# Altium schematic sheet Slot_periph.SchDoc: =title_
size 594 x 420 mm; Date: 06/04/2023; CheckedBy: EG; GD; GK; MS; DrawnBy: M. Gąska; DocumentNumber: 5; SheetNumber: 5; SheetTotal: 5; Title2: Slot periph; DivGrp: BE-CO; Projet: DI/OT Crate; Designer: G.Daniluk; CreateDate: 06/04/2023; CheckedDate: 06/04/2023
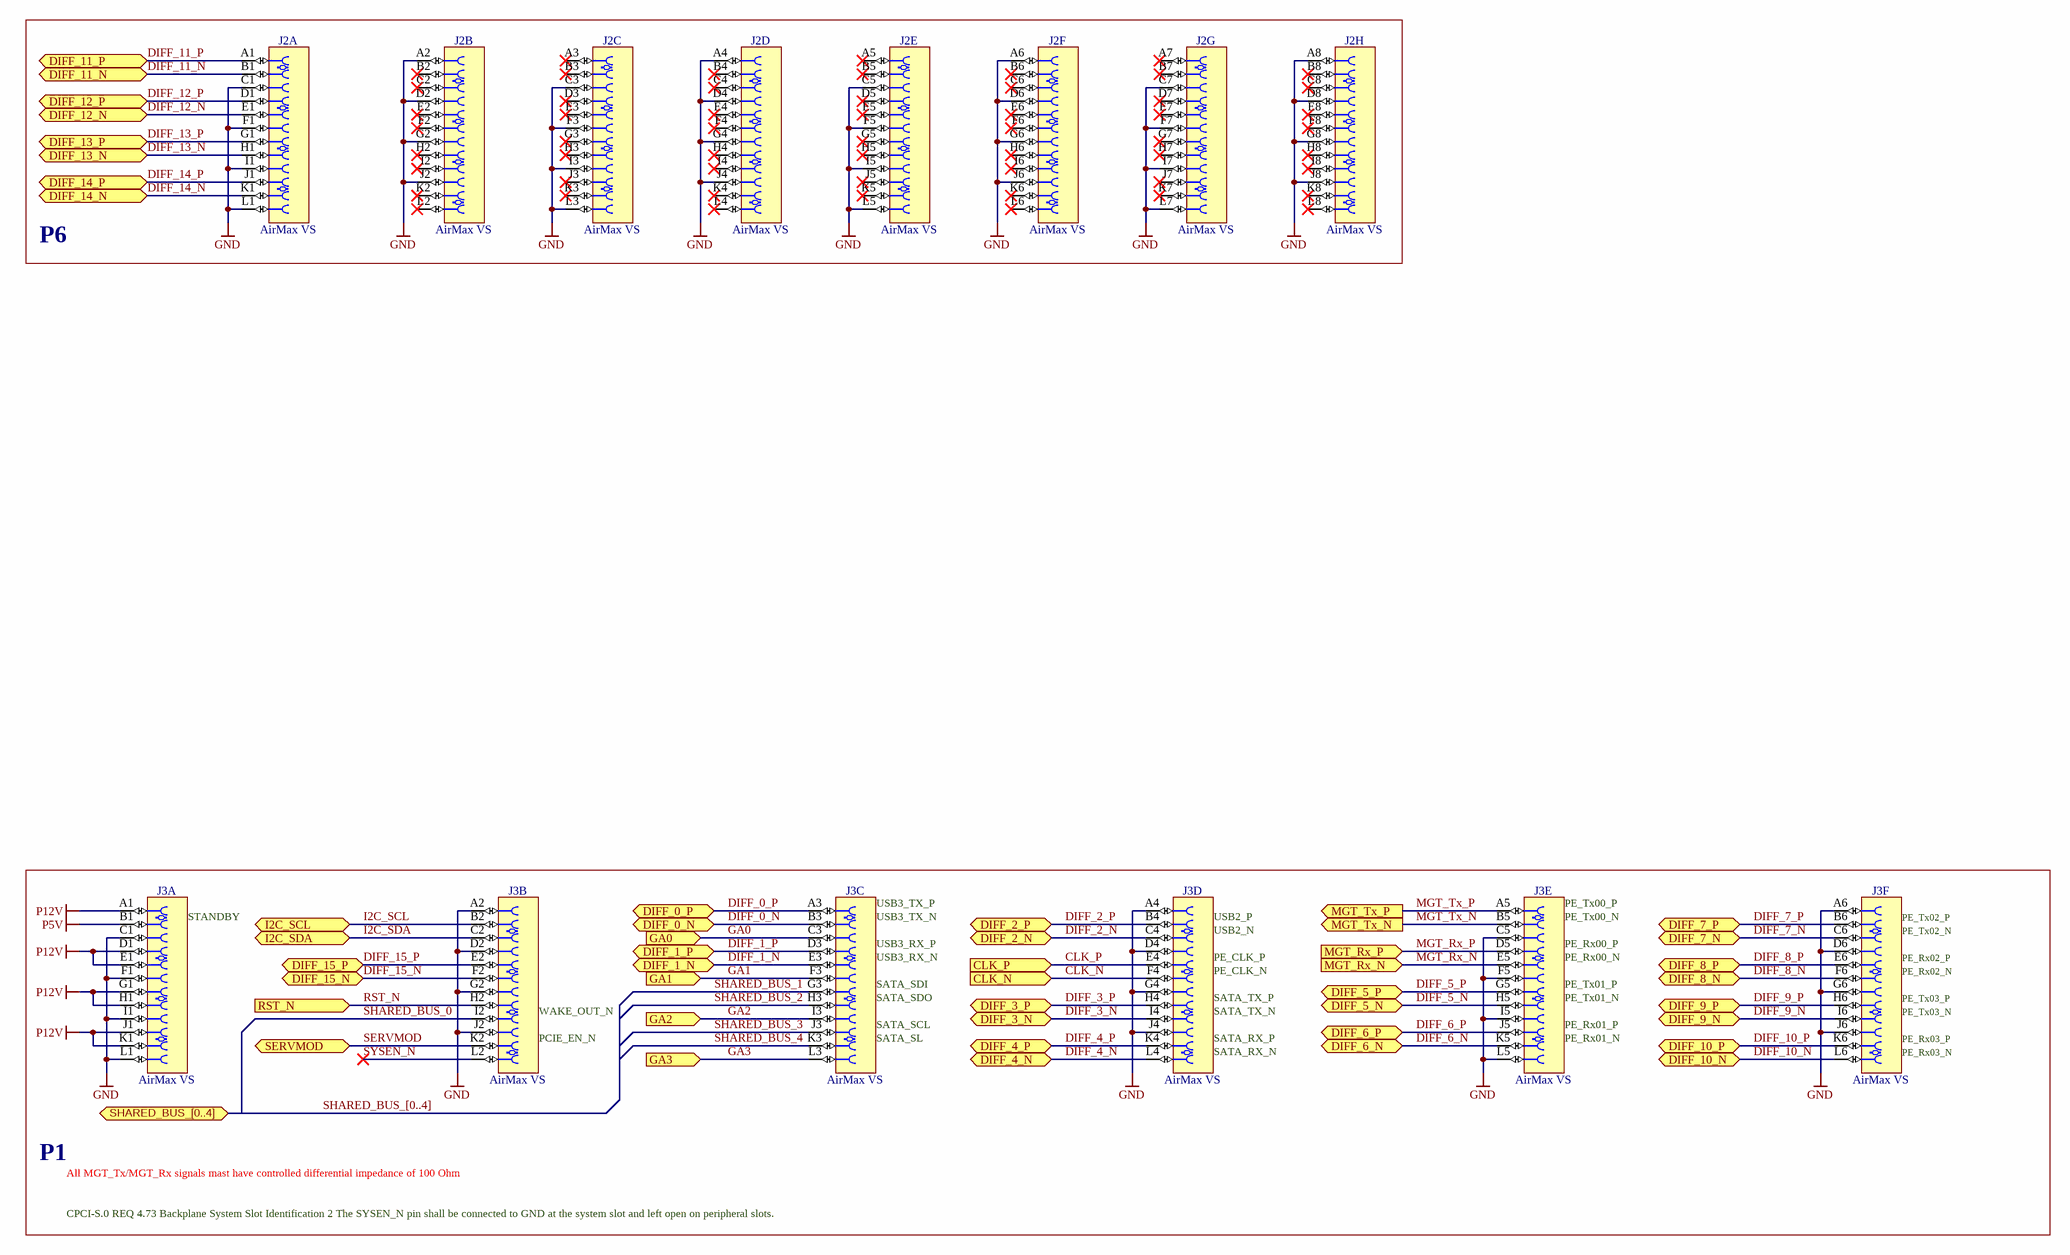
[diagram p0: Slot_periph.SchDoc]

## Parts
J2  AirMax VS  [AMPHENOL_10052842-101LF]  (parts A,B,C,D,E,F,G,H of 8)
J3  AirMax VS  [AMPHENOL_10052829-101LF]  (parts A,B,C,D,E,F of 6)

## Blocks framed on the sheet
P6: J2
P1: J3

## Ports
CLK_N (in), CLK_P (in), DIFF_0_N (bidir), DIFF_0_P (bidir), DIFF_1_N (bidir), DIFF_1_P (bidir), DIFF_2_N (bidir), DIFF_2_P (bidir), DIFF_3_N (bidir), DIFF_3_P (bidir), DIFF_4_N (bidir), DIFF_4_P (bidir), DIFF_5_N (bidir), DIFF_5_P (bidir), DIFF_6_N (bidir), DIFF_6_P (bidir), DIFF_7_N (bidir), DIFF_7_P (bidir), DIFF_8_N (bidir), DIFF_8_P (bidir), DIFF_9_N (bidir), DIFF_9_P (bidir), DIFF_10_N (bidir), DIFF_10_P (bidir), DIFF_11_N (bidir), DIFF_11_P (bidir), DIFF_12_N (bidir), DIFF_12_P (bidir), DIFF_13_N (bidir), DIFF_13_P (bidir), DIFF_14_N (bidir), DIFF_14_P (bidir), DIFF_15_N (bidir), DIFF_15_P (bidir), GA0 (in), GA1 (in), GA2 (in), GA3 (in), I2C_SCL (bidir), I2C_SDA (bidir), MGT_Rx_N (in), MGT_Rx_P (in), MGT_Tx_N (out), MGT_Tx_P (out), RST_N (in), SERVMOD (bidir), SHARED_BUS_[0..4] (bidir)

## Nets
GND: J2.A2 J2.A4 J2.A6 J2.A8 J2.C1 J2.C3 J2.C5 J2.C7 J2.D2 J2.D4 J2.D6 J2.D8 J2.F1 J2.F3 J2.F5 J2.F7 J2.G2 J2.G4 J2.G6 J2.G8 J2.I1 J2.I3 J2.I5 J2.I7 J2.J2 J2.J4 J2.J6 J2.J8 J2.L1 J2.L3 J2.L5 J2.L7 J3.A2 J3.A4 J3.A6 J3.C1 J3.C5 J3.D2 J3.D4 J3.D6 J3.F1 J3.F5 J3.G2 J3.G4 J3.G6 J3.I1 J3.I5 J3.J2 J3.J4 J3.J6 J3.L1 J3.L5
P5V: J3.B1
P12V: J3.A1 J3.D1 J3.E1 J3.G1 J3.H1 J3.J1 J3.K1
CLK_N: J3.F4 ; port CLK_N
CLK_P: J3.E4 ; port CLK_P
DIFF_0_N: J3.B3 ; port DIFF_0_N
DIFF_0_P: J3.A3 ; port DIFF_0_P
DIFF_1_N: J3.E3 ; port DIFF_1_N
DIFF_1_P: J3.D3 ; port DIFF_1_P
DIFF_2_N: J3.C4 ; port DIFF_2_N
DIFF_2_P: J3.B4 ; port DIFF_2_P
DIFF_3_N: J3.I4 ; port DIFF_3_N
DIFF_3_P: J3.H4 ; port DIFF_3_P
DIFF_4_N: J3.L4 ; port DIFF_4_N
DIFF_4_P: J3.K4 ; port DIFF_4_P
DIFF_5_N: J3.H5 ; port DIFF_5_N
DIFF_5_P: J3.G5 ; port DIFF_5_P
DIFF_6_N: J3.K5 ; port DIFF_6_N
DIFF_6_P: J3.J5 ; port DIFF_6_P
DIFF_7_N: J3.C6 ; port DIFF_7_N
DIFF_7_P: J3.B6 ; port DIFF_7_P
DIFF_8_N: J3.F6 ; port DIFF_8_N
DIFF_8_P: J3.E6 ; port DIFF_8_P
DIFF_9_N: J3.I6 ; port DIFF_9_N
DIFF_9_P: J3.H6 ; port DIFF_9_P
DIFF_10_N: J3.L6 ; port DIFF_10_N
DIFF_10_P: J3.K6 ; port DIFF_10_P
DIFF_11_N: J2.B1 ; port DIFF_11_N
DIFF_11_P: J2.A1 ; port DIFF_11_P
DIFF_12_N: J2.E1 ; port DIFF_12_N
DIFF_12_P: J2.D1 ; port DIFF_12_P
DIFF_13_N: J2.H1 ; port DIFF_13_N
DIFF_13_P: J2.G1 ; port DIFF_13_P
DIFF_14_N: J2.K1 ; port DIFF_14_N
DIFF_14_P: J2.J1 ; port DIFF_14_P
DIFF_15_N: J3.F2 ; port DIFF_15_N
DIFF_15_P: J3.E2 ; port DIFF_15_P
GA0: J3.C3 ; port GA0
GA1: J3.F3 ; port GA1
GA2: J3.I3 ; port GA2
GA3: J3.L3 ; port GA3
I2C_SCL: J3.B2 ; port I2C_SCL
I2C_SDA: J3.C2 ; port I2C_SDA
MGT_Rx_N: J3.E5 ; port MGT_Rx_N
MGT_Rx_P: J3.D5 ; port MGT_Rx_P
MGT_Tx_N: J3.B5 ; port MGT_Tx_N
MGT_Tx_P: J3.A5 ; port MGT_Tx_P
RST_N: J3.H2 ; port RST_N
SERVMOD: J3.K2 ; port SERVMOD
SHARED_BUS_0: J3.I2
SHARED_BUS_1: J3.G3
SHARED_BUS_2: J3.H3
SHARED_BUS_3: J3.J3
SHARED_BUS_4: J3.K3
SYSEN_N: J3.L2

Not connected (* = marked no-connect by the designer): J2 A3* A5* A7* B2* B3* B4* B5* B6* B7* B8* C2* C4* C6* C8* D3* D5* D7* E2* E3* E4* E5* E6* E7* E8* F2* F4* F6* F8* G3* G5* G7* H2* H3* H4* H5* H6* H7* H8* I2* I4* I6* I8* J3* J5* J7* K2* K3* K4* K5* K6* K7* K8* L2* L4* L6* L8*

## Buses and harness runs
bus SHARED_BUS_[0..4] = port SHARED_BUS_[0..4]

## Notes on the sheet
- (near J3) STANDBY
- (near J3) USB3_TX_P
- (near J3) USB3_TX_N
- (near J3) USB3_RX_P
- (near J3) USB3_RX_N
- (near J3) USB2_P
- (near J3) USB2_N
- (near J3) PE_CLK_P
- (near J3) PE_Tx00_P
- (near J3) PE_Tx00_N
- (near J3) PE_Rx00_P
- (near J3) PE_Rx00_N
- (near J3) PE_Rx02_P
- (near J3) PE_Tx02_N
- (near J3) PE_Tx02_P
- (near J3) WAKE_OUT_N
- (near J3) SATA_SDI
- (near J3) SATA_SDO
- (near J3) SATA_SCL
- (near J3) SATA_TX_P
- (near J3) SATA_TX_N
- (near J3) PE_CLK_N
- (near J3) PE_Rx01_P
- (near J3) PE_Tx01_N
- (near J3) PE_Tx01_P
- (near J3) PE_Tx03_P
- (near J3) PE_Tx03_N
- (near J3) PE_Rx02_N
- (near J3) PCIE_EN_N
- (near J3) SATA_SL
- (near J3) SATA_RX_P
- (near J3) SATA_RX_N
- (near J3) PE_Rx01_N
- (near J3) PE_Rx03_P
- (near J3) PE_Rx03_N
- All MGT_Tx/MGT_Rx signals mast have controlled differential impedance of 100 Ohm
- CPCI-S.0 REQ 4.73 Backplane System Slot Identification 2
  The SYSEN_N pin shall be connected to GND at the system slot and left open on peripheral slots.
- Project/Equipment
- Document
- File
- Designer
- Drawn by
- Check.by
- Last Mod.
- Copyright WUT ISE 2024.
  This documentation describes Open Hardware and is licensed under the CERN OHL-W v.2.0. You may redistribute and modify this documentation under the terms of the CERN OHL-W v.2.0. (http://ohwr.org/CERNOHL). This documentation is distributed WITHOUT ANY EXPRESS OR IMPLIED WARRANTY, INCLUDING OF MERCHANTABILITY, SATISFACTORY QUALITY AND FITNESS FOR A PARTICULAR PURPOSE. Please see the CERN OHL v.2.0 for applicable conditions.
- Contact
- Print Date
- Sheet
- Size
- A2
- of
- Rev

## Library data of the parts
J2 = AMPHENOL_10052842-101LF: 96 Contacts Receptacle, 8 Columns, 4 Pairs per Column; Part Description: 96 Contacts, 2mm Pitch, 8 Columns, 4 Pairs per Column, Vertical Receptacle; Part Number: AMPHENOL_10052842-101LF; Component Kind: Standard; Component Type: Standard; Pin Count: 96; Family: AirMax VS; Mounted: Yes; Socket: No; SMD: No; PressFit: Yes; Sense: No; Status: None; Manufacturer: AMPHENOL; Manufacturer Part Number: 10052842-101LF; ComponentHeight: 10.85mm; HelpURL: \\cern.ch\dfs\Applications\Altium\Datasheets\AMPHENOL_10052842-101LF.pdf; ComponentLink1URL: \\cern.ch\dfs\Applications\Altium\Datasheets\AMPHENOL_10052842-101LF_Application.pdf; ComponentLink1Description: Application; Author: CERN DEM MR; CreateDate: 30.04.2019; LatestRevisionDate: 30.04.2019
J3 = AMPHENOL_10052829-101LF: 72 Contacts Receptacle, 6 Columns, 4 Pairs per Column; Part Description: 72 Contacts, 2mm Pitch, 6 Columns, 4 Pairs per Column, Vertical Receptacle; Part Number: AMPHENOL_10052829-101LF; Component Kind: Standard; Component Type: Standard; Pin Count: 72; Family: AirMax VS; Mounted: Yes; Socket: No; SMD: No; PressFit: Yes; Sense: No; Status: None; Manufacturer: AMPHENOL; Manufacturer Part Number: 10052829-101LF; ComponentHeight: 10.85mm; HelpURL: \\cern.ch\dfs\Applications\Altium\Datasheets\AMPHENOL_10052829-101LF.pdf; ComponentLink1URL: \\cern.ch\dfs\Applications\Altium\Datasheets\AMPHENOL_10052829-101LF_Application.pdf; ComponentLink1Description: Application; Author: CERN DEM MR; CreateDate: 30.04.2019; LatestRevisionDate: 30.04.2019